# EAGLE board ADC_12_channel (EAGLE 7.2.0)
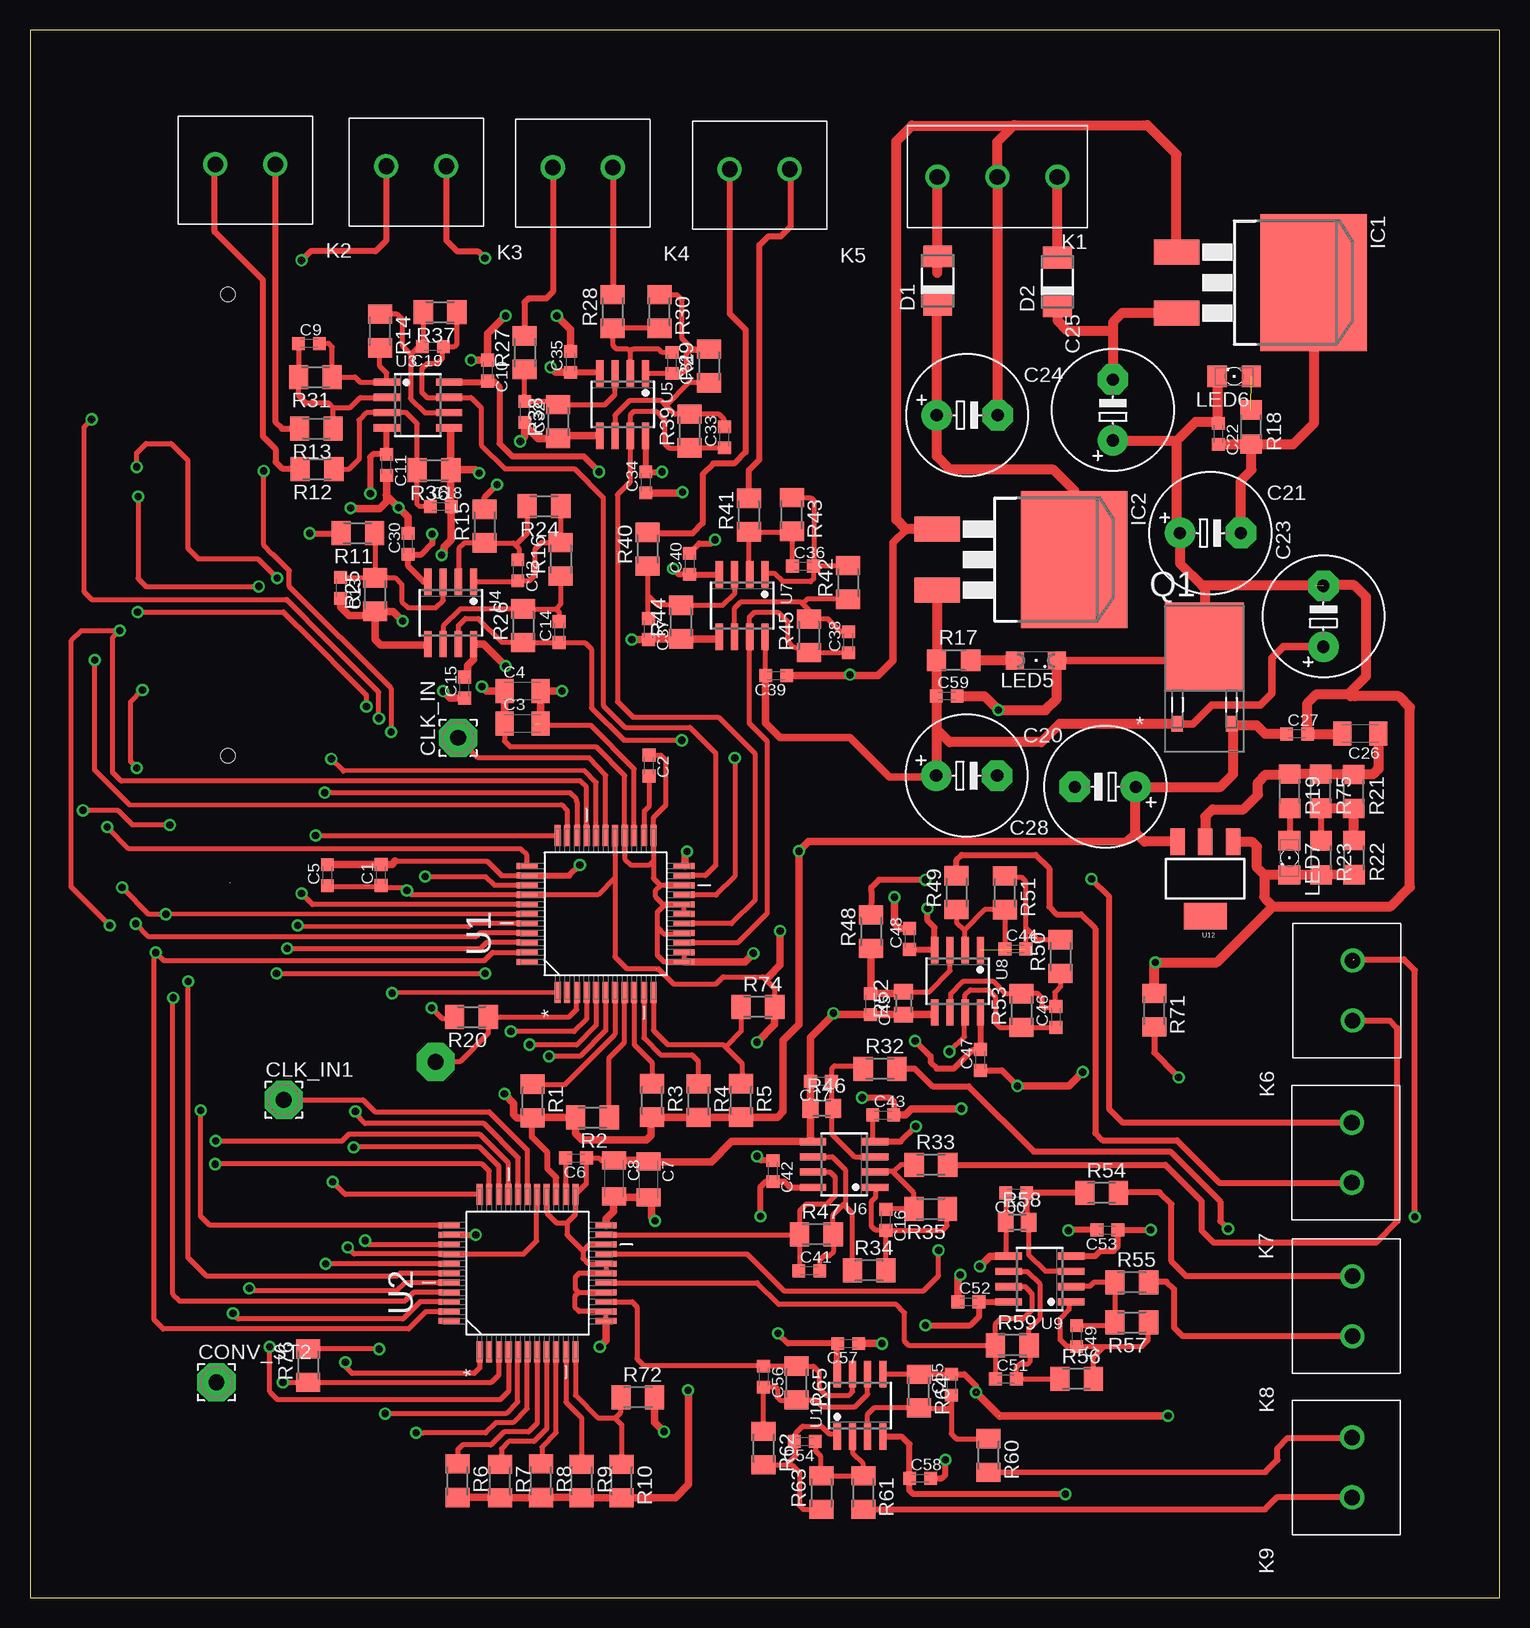
[diagram p5: board, top side]
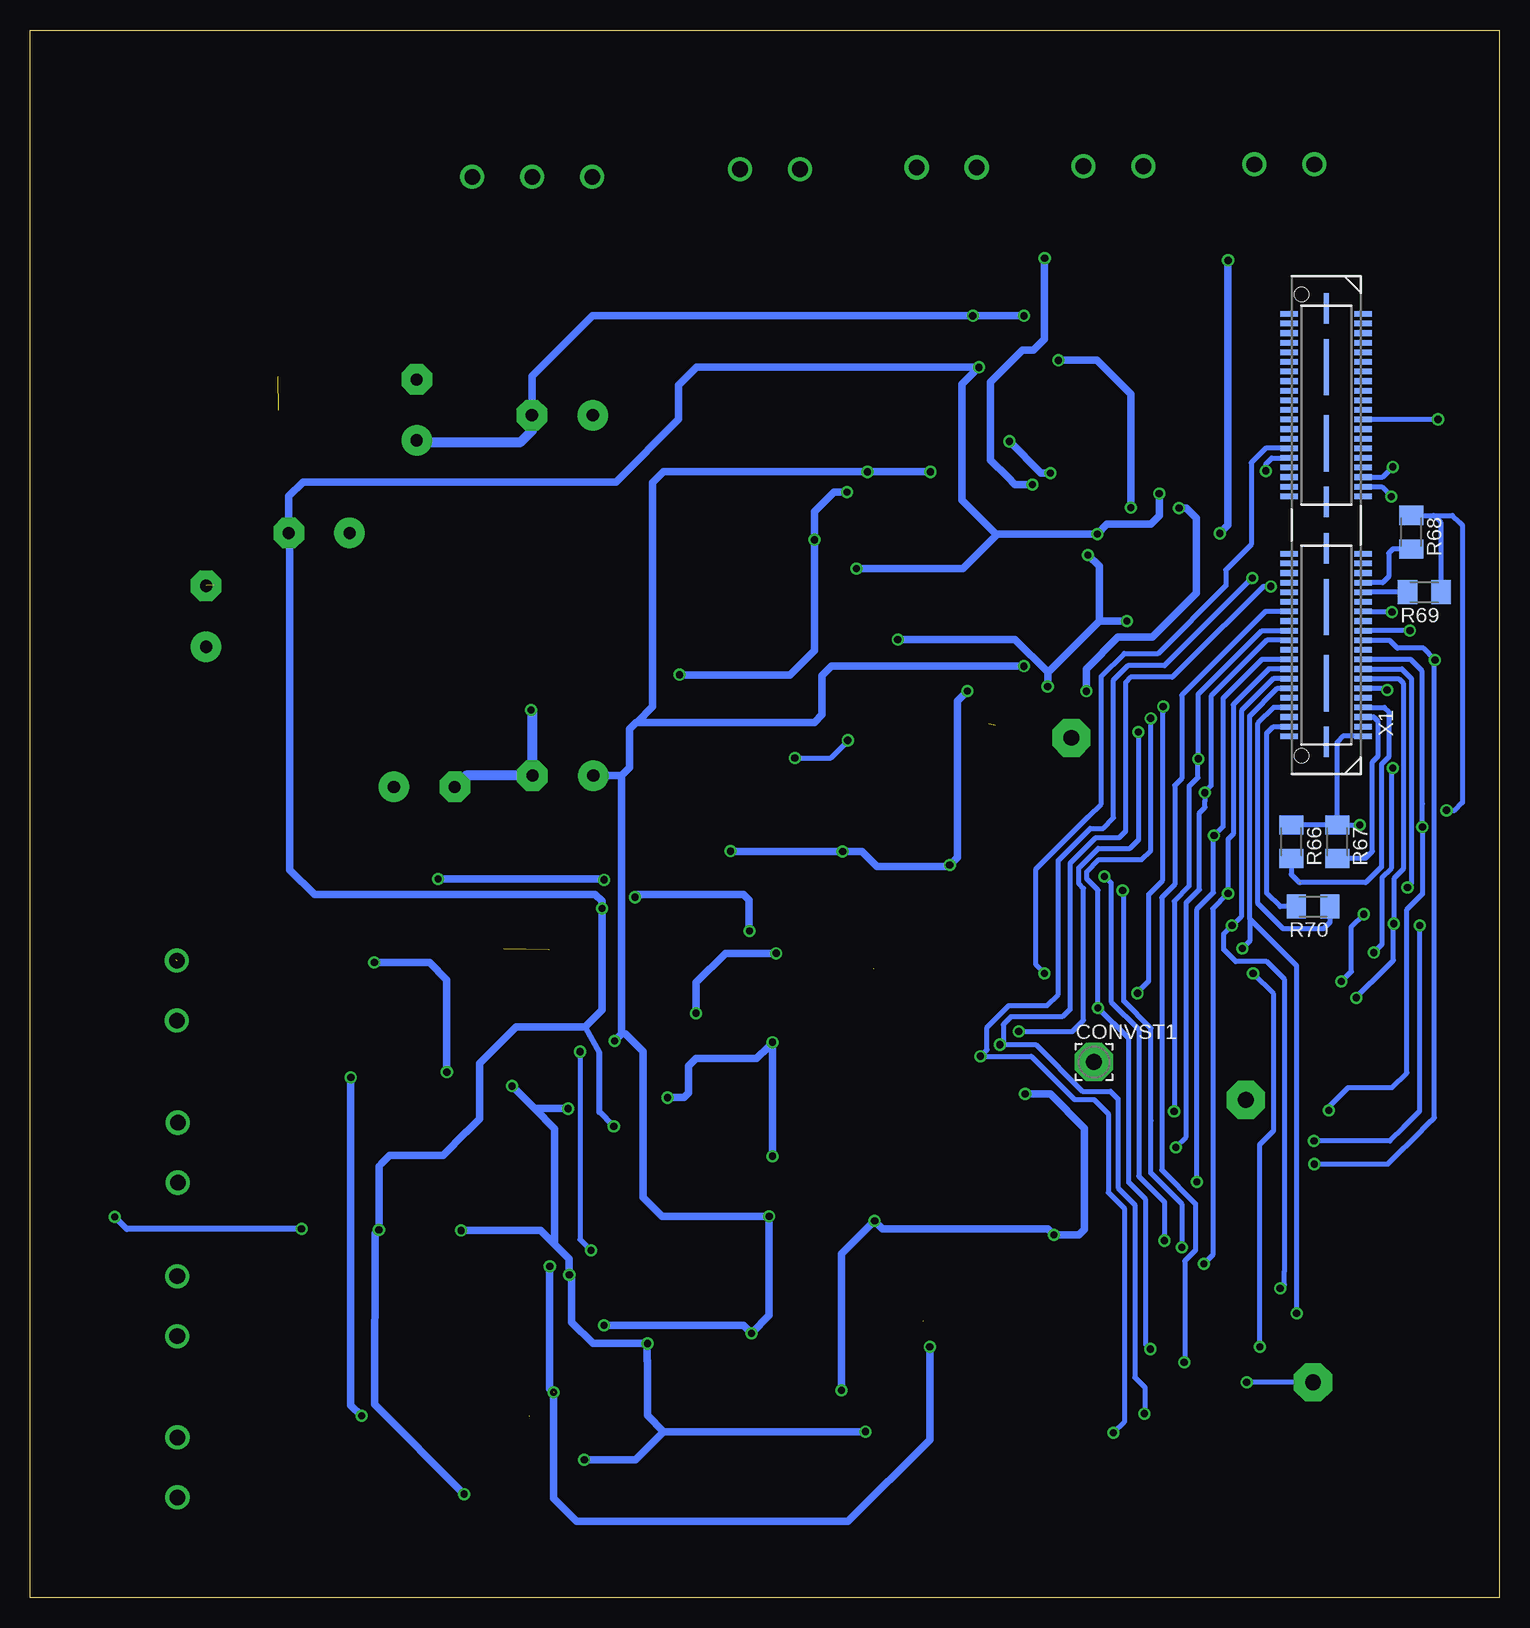
[diagram p6: board, bottom side, seen from below]

Size 122.5 x 130.68 mm. Coordinates in mm from the lower left corner, seen from the top.
Outline: 122.48,130.68 0.03,130.68 0.03,18.08
Outline: 0,18.34 0.03,18.34 0.03,0 122.5,0 122.5,130.68 122.48,130.68
Copper layers (1*16): Top 0.035mm / dielectric 1.5mm / Bottom 0.035mm
Design rules "default *": minimum track width 16mil, minimum drill 24mil, track to track 10mil, track to pad 10mil, pad to pad 10mil, via to via 10mil, smd to smd 8mil, copper to edge 40mil, drill to drill 8mil, minimum pad ring 14mil, minimum via ring 8mil, stop-mask expansion 4mil, vias tented up to drill 0mil, thermal gap 10mil

## Footprints (pad centres in the part's own frame; a part is rotated, then mirrored left to right if it is on the bottom)
C0603K = smd 1.05 x 1.08: 1 -0.875,0; 2 0.875,0
C1206K = smd 1.5 x 2: 1 -1.5,0; 2 1.5,0
E5-10,5 = drill 1.016 pad 2.54: + -2.54,0 | drill 1.016 pad 2.54 octagon: - 2.54,0
3,17/1,3 = drill 1.321 pad 3.175 octagon: 1 0,0
DO-214AC = smd 1.8 x 2.4: A 2.025,0; C -2.025,0
D2PACK = smd 2.083 x 3.81: 1 -2.54,-8.89; 3 2.54,-8.89 | smd 11.43 x 8.89: 2 0,2.54
691131710003 = drill 1.3: 1 -5,0; 2 0,0; 3 5,0
691101710002 = drill 1.3: 1 -5,0; 2 0,0
SML1206 = smd 1.5 x 1.5: A 1.75,0; C -1.75,0
1206 = smd 1.6 x 1.803: A -1.422,0; C 1.422,0
TO225P972X240-3N = smd 0.94 x 1.321: 1 -2.261,-6.299; 3 2.261,-6.299 | smd 6.604 x 7.315: 2 0,0.152
M1206 = smd 1.6 x 2: 1 -1.4,0; 2 1.4,0
R1206 = smd 1.6 x 1.803: 1 -1.422,0; 2 1.422,0
M0805 = smd 1.3 x 1.6: 1 -0.95,0; 2 0.95,0
QFP80P1390X1390X245-44N = smd 1.753 x 0.508: 1 -6.553,3.988; 2 -6.553,3.2; 3 -6.553,2.388; 4 -6.553,1.6; 5 -6.553,0.787; 6 -6.553,0; 7 -6.553,-0.787; 8 -6.553,-1.6; 9 -6.553,-2.388; 10 -6.553,-3.2; 11 -6.553,-3.988; 23 6.553,-3.988; 24 6.553,-3.2; 25 6.553,-2.388; 26 6.553,-1.6; 27 6.553,-0.787; 28 6.553,0; 29 6.553,0.787; 30 6.553,1.6; 31 6.553,2.388; 32 6.553,3.2; 33 6.553,3.988 | smd 0.508 x 1.753: 12 -3.988,-6.553; 13 -3.2,-6.553; 14 -2.388,-6.553; 15 -1.6,-6.553; 16 -0.787,-6.553; 17 0,-6.553; 18 0.787,-6.553; 19 1.6,-6.553; 20 2.388,-6.553; 21 3.2,-6.553; 22 3.988,-6.553; 34 3.988,6.553; 35 3.2,6.553; 36 2.388,6.553; 37 1.6,6.553; 38 0.787,6.553; 39 0,6.553; 40 -0.787,6.553; 41 -1.6,6.553; 42 -2.388,6.553; 43 -3.2,6.553; 44 -3.988,6.553
SO08 = smd 0.6 x 2.2: 1 -1.905,-2.6; 2 -0.635,-2.6; 3 0.635,-2.6; 4 1.905,-2.6; 5 1.905,2.6; 6 0.635,2.6; 7 -0.635,2.6; 8 -1.905,2.6
SOT223 = smd 1.219 x 2.235: 1 -2.311,-3.099; 2 0,-3.099; 3 2.311,-3.099 | smd 3.6 x 2.2: 4 0,3.099
QTE-040 = smd 0.46 x 1.45: 1 -17.595,3.09; 2 -17.595,-3.08; 3 -16.795,3.09; 4 -16.795,-3.08; 5 -15.995,3.09; 6 -15.995,-3.08; 7 -15.195,3.09; 8 -15.195,-3.08; 9 -14.395,3.09; 10 -14.395,-3.08; 11 -13.595,3.09; 12 -13.595,-3.08; 13 -12.795,3.09; 14 -12.795,-3.08; 15 -11.995,3.09; 16 -11.995,-3.08; 17 -11.195,3.09; 18 -11.195,-3.08; 19 -10.395,3.09; 20 -10.395,-3.08; 21 -9.595,3.09; 22 -9.595,-3.08; 23 -8.795,3.09; 24 -8.795,-3.08; 25 -7.995,3.09; 26 -7.995,-3.08; 27 -7.195,3.09; 28 -7.195,-3.08; 29 -6.395,3.09; 30 -6.395,-3.08; 31 -5.595,3.09; 32 -5.595,-3.08; 33 -4.795,3.09; 34 -4.795,-3.08; 35 -3.995,3.09; 36 -3.995,-3.08; 37 -3.195,3.09; 38 -3.195,-3.08; 39 -2.395,3.09; 40 -2.395,-3.08; 41 2.405,3.09; 42 2.405,-3.08; 43 3.205,3.09; 44 3.205,-3.08; 45 4.005,3.09; 46 4.005,-3.08; 47 4.805,3.09; 48 4.805,-3.08; 49 5.605,3.09; 50 5.605,-3.08; 51 6.405,3.09; 52 6.405,-3.08; 53 7.205,3.09; 54 7.205,-3.08; 55 8.005,3.09; 56 8.005,-3.08; 57 8.805,3.09; 58 8.805,-3.08; 59 9.605,3.09; 60 9.605,-3.08; 61 10.405,3.09; 62 10.405,-3.08; 63 11.205,3.09; 64 11.205,-3.08; 65 12.005,3.09; 66 12.005,-3.08; 67 12.805,3.09; 68 12.805,-3.08; 69 13.605,3.09; 70 13.605,-3.08; 71 14.405,3.09; 72 14.405,-3.08; 73 15.205,3.09; 74 15.205,-3.08; 75 16.005,3.09; 76 16.005,-3.08; 77 16.805,3.09; 78 16.805,-3.08; 79 17.605,3.09; 80 17.605,-3.08 | smd 2.54 x 0.43: M1 -18.065,0; M2 -1.935,0; M5 1.935,0; M6 18.065,0 | smd 4.7 x 0.43: M3 -13.175,0; M4 -6.825,0; M7 6.825,0; M8 13.175,0 | hole 1.19: -19.24,2.04; 19.24,2.04

## Placement (x,y rotation side)
C1  0.1u  [C0603K]  29.26,60.25 90 top
C2  0.1uf  [C0603K]  51.59,69.37 270 top
C3  47u  [C1206K]  41.05,72.87 0 top
C4  47u  [C1206K]  41.05,75.56 0 top
C5  0.1u  [C0603K]  24.79,60.22 90 top
C6  [C0603K]  45.52,36.65 180 top
C7  47u  [C1206K]  51.56,34.87 270 top
C8  47u  [C1206K]  48.69,34.95 270 top
C9  0.1u  [C0603K]  23.27,104.55 0 top
C10  0.1u  [C0603K]  38.15,102.29 270 top
C11  0.1u  [C0603K]  29.72,94.44 270 top
C12  0.1u  [C0603K]  40.67,85.65 270 top
C13  0.1u  [C0603K]  25.91,84.18 270 top
C14  0.1u  [C0603K]  44.12,80.49 90 top
C15  0.1u  [C0603K]  36.22,75.87 90 top
C16  0.1u  [C0603K]  71.35,31.5 270 top
C17  0.1u  [C0603K]  65.94,43.05 180 top
C18  0.1u  [C0603K]  34.24,90.96 0 top
C19  0.1u  [C0603K]  33.58,104.29 180 top
C20  250uF  [E5-10,5]  78.08,68.53 0 top
C21  250uF  [E5-10,5]  98.4,88.75 0 top
C22  0.1u  [C0603K]  99.06,97.03 270 top
C23  1000uF/35V  [E5-10,5]  107.82,81.81 90 top
C24  1000uF/35V  [E5-10,5]  78.13,98.58 0 top
C25  1000uF/35v  [E5-10,5]  90.27,99.01 90 top
C26  [C1206K]  110.9,72.03 180 top
C27  0.1u  [C0603K]  105.61,72.01 0 top
C28  1000uF/35V  [E5-10,5]  89.64,67.59 180 top
C30  0.1u  [C0603K]  31.52,87.83 90 top
C31  0.1u  [C0603K]  53.52,102.92 270 top
C32  0.1u  [C0603K]  41.25,98.86 270 top
C33  0.1u  [C0603K]  57.89,96.72 90 top
C34  0.1u  [C0603K]  51.33,92.96 90 top
C35  0.1u  [C0603K]  45.06,103.02 90 top
C36  0.1u  [C0603K]  64.44,85.98 0 top
C37  0.1u  [C0603K]  51.56,80.75 270 top
C38  0.1u  [C0603K]  68.22,79.63 90 top
C39  0.1u  [C0603K]  62.2,76.86 180 top
C40  0.1u  [C0603K]  54.99,86.18 90 top
C41  0.1u  [C0603K]  64.97,27.25 0 top
C42  0.1u  [C0603K]  61.93,35.56 270 top
C43  0.1u  [C0603K]  71.12,40.23 0 top
C44  0.1u  [C0603K]  82.14,54.08 0 top
C45  0.1u  [C0603K]  70.05,49.48 270 top
C46  0.1u  [C0603K]  85.52,48.41 90 top
C47  0.1u  [C0603K]  79.22,44.83 90 top
C48  0.1u  [C0603K]  73.33,54.91 90 top
C49  0.1u  [C0603K]  87.25,21.82 270 top
C50  0.1u  [C0603K]  82.22,33.73 180 top
C51  0.1u  [C0603K]  81.36,18.24 0 top
C52  0.1u  [C0603K]  78.23,24.66 0 top
C53  0.1u  [C0603K]  89.81,30.66 180 top
C54  0.1u  [C0603K]  64.59,13.03 180 top
C55  0.1u  [C0603K]  76.81,17.75 90 top
C56  0.1u  [C0603K]  61.16,18.44 270 top
C57  0.1u  [C0603K]  68.22,21.18 180 top
C58  0.1u  [C0603K]  74.19,9.96 0 top
C59  0.1u  [C0603K]  76.43,75.16 0 top
CLK_IN  [3,17/1,3]  35.69,71.68 90 top
CLK_IN1  [3,17/1,3]  21.16,41.5 0 top
CONV_ST2  [3,17/1,3]  15.54,17.96 0 top
CONVST1  [3,17/1,3]  33.81,44.65 0 bottom
D1  [DO-214AC]  75.67,109.78 90 top
D2  [DO-214AC]  85.65,109.68 90 top
IC1  LM317BD2T  [D2PACK]  104.47,109.63 270 top
IC2  LM317BD2T  [D2PACK]  84.51,86.54 270 top
K1  691131710003  [691131710003]  80.65,118.44 180 top
K2  691101710002  [691101710002]  15.44,119.48 180 top
K3  691101710002  [691101710002]  29.69,119.33 180 top
K4  691101710002  [691101710002]  43.59,119.23 180 top
K5  691101710002  [691101710002]  58.32,119.08 180 top
K6  691101710002  [691101710002]  110.26,53.11 90 top
K7  691101710002  [691101710002]  110.19,39.6 90 top
K8  691101710002  [691101710002]  110.24,26.8 90 top
K9  691101710002  [691101710002]  110.21,13.36 90 top
LED5  [SML1206]  83.87,78.13 180 top
LED6  [1206]  100.38,101.8 180 top
LED7  [1206]  104.98,61.67 270 top
Q1  L78M12ABDT  [TO225P972X240-3N]  97.89,79.15 0 top
R1  10k  [M1206]  41.91,41.4 270 top
R2  10k  [M1206]  46.89,40.03 180 top
R3  10k  [M1206]  51.87,41.45 270 top
R4  10k  [M1206]  55.73,41.43 270 top
R5  10k  [M1206]  59.28,41.45 270 top
R6  10k  [M1206]  35.64,9.75 270 top
R7  10k  [M1206]  39.19,9.73 270 top
R8  10k  [M1206]  42.6,9.75 270 top
R9  10k  [M1206]  46,9.73 270 top
R10  10k  [M1206]  49.33,9.73 270 top
R11  10M  [M1206]  27.33,88.75 180 top
R12  10M  [M1206]  23.93,94.08 180 top
R13  10M  [M1206]  23.88,97.46 180 top
R14  10M  [M1206]  29.18,105.59 270 top
R15  10M  [M1206]  37.9,89.33 90 top
R16  10M  [M1206]  44.25,86.56 90 top
R17  2.2k  [R1206]  76.99,78.16 0 top
R18  2.2k  [R1206]  101.78,97.59 270 top
R19  2.2k  [R1206]  105,67.23 270 top
R20  0  [M1206]  36.8,48.41 180 top
R21  100k  [R1206]  110.34,67.21 270 top
R22  20k(19k)  [R1206]  110.36,61.7 270 top
R23  20k(19k)  [R1206]  107.62,61.67 270 top
R24  10M  [M1206]  42.85,90.98 180 top
R25  10M  [M1206]  28.75,83.62 90 top
R26  10M  [M1206]  41.12,81.03 90 top
R27  10M  [M1206]  41.25,103.78 90 top
R28  10M  [M1206]  48.56,107.21 90 top
R29  10M  [M1206]  56.59,102.67 90 top
R30  10M  [M1206]  52.48,107.21 270 top
R31  10M  [M1206]  23.8,101.75 180 top
R32  10M  [M1206]  70.87,44.09 0 top
R33  10M  [M1206]  75.11,36.09 0 top
R34  10M  [M1206]  69.95,27.28 0 top
R35  10M  [M1206]  75.08,32.41 180 top
R36  10M  [M1206]  33.68,94.01 180 top
R37  10M  [M1206]  34.19,107.16 180 top
R38  10M  [M1206]  44.02,98.04 90 top
R39  10M  [M1206]  54.99,97.26 90 top
R40  10M  [M1206]  51.49,87.4 90 top
R41  10M  [M1206]  59.92,90.25 90 top
R42  10M  [M1206]  68.2,84.63 90 top
R43  10M  [M1206]  63.5,90.3 270 top
R44  10M  [M1206]  54.25,81.33 90 top
R45  10M  [M1206]  64.92,80.19 90 top
R46  10M  [M0805]  66.01,40.79 0 top
R47  10M  [M1206]  65.56,30.3 0 top
R48  10M  [M1206]  70.1,55.52 90 top
R49  10M  [M1206]  77.24,58.78 90 top
R50  10M  [M1206]  85.9,53.44 90 top
R51  10M  [M1206]  81.28,58.75 270 top
R52  10M  [M0805]  72.82,49.56 90 top
R53  10M  [M1206]  82.65,48.95 90 top
R54  10M  [M1206]  89.33,33.73 0 top
R55  10M  [M1206]  91.85,26.29 0 top
R56  10M  [M1206]  87.25,18.24 0 top
R57  10M  [M1206]  91.85,22.96 180 top
R58  10M  [M0805]  82.3,31.29 0 top
R59  10M  [M1206]  81.89,21.06 0 top
R60  10M  [M1206]  79.91,11.86 270 top
R61  10M  [M1206]  69.47,8.76 270 top
R62  10M  [M1206]  61.16,12.47 270 top
R63  10M  [M1206]  65.96,8.76 90 top
R64  10M  [M1206]  74.12,17.22 270 top
R65  10M  [M1206]  63.91,17.91 270 top
R66  500  [M1206]  17.37,63.02 270 bottom
R67  500  [M1206]  13.54,63.02 270 bottom
R68  500  [M1206]  7.37,88.82 270 bottom
R69  500  [M1206]  6.27,83.82 180 bottom
R70  500  [M1206]  15.54,57.61 180 bottom
R71  0  [M1206]  93.73,48.97 270 top
R72  0  [M1206]  50.67,16.71 0 top
R74  0  [M1206]  60.68,49.25 0 top
R75  100k  [R1206]  107.59,67.23 270 top
R76  0  [M1206]  23.19,19.35 90 top
U1  AD7864ASZ-1  [QFP80P1390X1390X245-44N]  47.98,57 90 top
U2  AD7864ASZ-1  [QFP80P1390X1390X245-44N]  41.48,27.05 90 top
U3  TL082D  [SO08]  32.33,99.42 270 top
U4  TL082D  [SO08]  35.08,82.09 180 top
U5  TL082D  [SO08]  49.4,99.47 180 top
U6  TL082D  [SO08]  67.87,36.12 90 top
U7  TL082D  [SO08]  59.36,82.7 180 top
U8  TL082D  [SO08]  77.32,51.38 180 top
U9  TL082D  [SO08]  84.18,26.57 90 top
U10  TL082D  [SO08]  69.19,16.03 0 top
U12  V_REG_317SMD  [SOT223]  97.97,59.92 180 top
X1  QTE-040  [QTE-040]  14.45,89.41 90 bottom

## Tracks (layer width: path | path; a pad name or v marks a point on that pad's centre or on a via)
3V
  Top 0.508: 107.62,65.79 R23.1
  Top 0.813: R75.2 107.62,65.79 R21.2 110.36,65.76 R22.1
ADC1
  Top 0.406: R37.1 35.59,104.5 35.38,104.29 C19.1 34.39,104.23 34.39,103.33 33.96,102.9 33.15,102.9 32.66,102.41 32.66,100.48 33.1,100.05 U3.7 36.75,100.05 37.62,99.19 37.62,96.09 39.6,94.11 45.39,94.11 47.78,91.72 47.78,74.37 49.61,72.54 55.02,72.54 57.15,70.41 57.15,61.04 56.31,60.2 U1.21
ADC2  (via drill 0.6)
  Top 0.406: v54.33,71.48 49.5,71.48 46.81,74.17 46.81,79.07 46.26,79.62 C14.1 R26.1 41.09,79.65 39.34,79.65 37.36,81.64 36.3,81.64 35.71,81.05 U4.7 | v58.75,70 58.75,60.12 57.2,58.57 54.56,58.57 U1.19
  Bottom 0.406: v54.33,71.48 54.33,71.4 55.73,70 v58.75,70
ADC3
  Top 0.406: U1.16 54.56,56.19 58.5,56.19 60.43,58.11 60.43,70.36 57.38,73.41 50.27,73.41 48.97,74.7 48.97,91.95 50.04,93.01 U5.7 50.06,96.89 50.06,98.63 50.34,98.91 52.17,98.91 52.91,98.17 52.91,96.22 53.29,95.83 54.97,95.83 R39.1 C33.1
ADC4
  Top 0.406: 59.94,80.15 59.94,81.71 60.35,82.12 62.38,82.12 63.17,81.33 63.17,79.73 63.66,79.24 R45.1 68.19,78.79 C38.1 | 59.94,80.15 U7.7 | 59.94,80.15 59.94,72.9 61.42,71.42 61.42,57.02 59,54.61 U1.14
ADC5
  Top 0.406: U6.7 66.7,35.48 67.11,35.08 67.11,33.5 66.4,32.79 64.69,32.79 64.16,32.26 R47.1 | R47.1 64.16,27.31 C41.1 | U2.21 64.11,30.25 R47.1
ADC6  (via drill 0.6)
  Top 0.406: C46.1 R53.1 80.82,47.55 80.47,47.9 80.47,50.09 79.88,50.67 78.36,50.67 77.95,50.27 U8.7 77.9,48.73 77.9,46.76 v76.66,45.52 | U2.19 59.79,28.65 62.86,25.58 74.47,25.58 75.74,26.85 v75.74,28.96
  Bottom 0.406: v76.66,45.52 76.66,29.87 v75.74,28.96
ADC7
  Top 0.406: U9.7 82.96,25.93 83.36,25.53 83.36,25.5 83.52,25.35 83.52,23.98 82.78,23.24 80.9,23.24 80.44,22.78 80.44,21.1 R59.1 | R59.1 C51.1 | U2.16 60.6,26.26 62.43,24.43 72.21,24.43 72.9,23.75 72.9,21.39 73.28,21.01 80.44,21.01 R59.1
ADC8
  Top 0.406: U2.14 50.19,24.66 50.6,24.26 50.6,19.91 51.16,19.35 61.12,19.35 C56.1 R65.1 65.3,19.31 65.79,18.82 65.79,17.45 66.34,16.89 68.3,16.89 68.58,17.17 68.58,18.6 U10.7
AGND  (via drill 0.6)  (3 unrouted)
  Top 0.254: 54.53,53.03 U1.12
  Top 0.406: U1.20 52.55,59.38 | U1.18 52.93,57.78 52.27,57.12 52.27,55.91 52.3,55.88 | 52.3,55.88 52.83,55.35 54.48,55.35 U1.15 | 52.3,55.88 52.3,53.54 52.81,53.03 54.51,53.03 U1.12 U1.13 | U1.17 U1.18 | U1.18 52.78,57.78 52.15,58.42 52.15,58.98 52.55,59.38 | 34.9,97.48 U3.5 35.08,97.36 | U2.26 43.08,32.08 43.92,31.24 44.75,31.24 | 44.75,31.24 45.47,31.95 U2.23 46.39,34.53 C6.1 47.42,36.65 47.62,36.45 C8.1 | U2.20 46.63,29.44 46.1,28.9 | 46.1,28.9 46.1,28.27 46.53,27.84 U2.18 U2.17 45.77,27.05 45.44,26.72 45.44,25.73 45.72,25.45 | U2.12 U2.13 45.77,23.85 45.44,24.18 45.44,25.17 45.72,25.45 | 44.75,31.24 44.75,30.25 46.1,28.9 | R36.1 35.08,94.26 35.31,94.03 | 35.08,90.99 C18.2 | 44.24,96.87 R38.1 44,96.62 | C17.2 | R52.1 | 75.23,48.6 U8.5 | U9.5 81.35,28.7 R58.1 C50.2 | U10.5 R64.1 74.13,18.63 C55.2 | 33.08,79.4 U4.5 | 28.4,81.86 R25.1 | 51.49,36.45 C7.1 | 50.18,79.87 v50.16,79.88 | 57.28,79.93 U7.5 | 66.98,48.64 67.06,48.64 v66.98,48.72 | 70.02,48.64 C45.2 | 45.72,25.45 U2.15 | 94.64,44.53 94.64,44.5 | 47.96,23.09 48.01,23.04 | C32.2 41.25,97.74 | v37.44,93.75 37.41,93.73 | 51.97,61.42 U1.23 51.97,65.02 52.98,66.04 52.98,69.82 52.57,70.24 C2.1 | 51.97,61.42 51.97,59.97 52.55,59.38 | 51.97,61.42 51.64,61.09 50.09,61.09 49.58,61.59 U1.26 49.58,68.53 47.17,70.94 40,70.94 39.55,71.4 C3.1
  Top 0.508: C55.2 77.89,18.63 78.87,17.65 v78.87,17.12 | C8.1 | 65.06,38.23 U6.5 | 51.59,36.35 C7.1 | R71.2 93.73,45.44 94.64,44.53 | 94.64,44.5 v95.76,43.38 | 51.62,79.93 C37.2
  Top 0.61: C3.1 C4.1 38.05,75.56 v37.67,75.95 | R36.1 35.08,90.99 | U5.5 44.24,96.87 | C17.2 R46.1 65.06,38.23 | C45.2 R52.1 | R52.1 75.23,48.6 | C13.2 25.91,82.57 26.62,81.86 28.4,81.86 | C8.1 51.49,36.45 | 33.08,79.4 29.21,79.4 28.75,79.86 R25.1 30.25,82.22 v31.06,81.41 | C37.2 50.18,79.87 | 57.28,79.93 R44.1 51.62,79.93 | U9.5 80.04,28.47 v79.17,27.61 | U6.5 58.5,38.02 56.82,36.35 51.59,36.35 | C17.2 65.06,46.72 66.98,48.64 | 67.06,48.64 70.02,48.64 | v60.3,53.72 59.59,53.01 U1.12 | C18.2 35.11,88.17 34.52,87.58 34.52,87.12 v34.32,86.92 | 41.25,97.74 42.37,96.62 44,96.62 | 35.08,97.36 35.08,94.26 | 35.31,94.03 37.11,94.03 37.41,93.73 | C32.2 41.25,96.77 v40.87,96.39 | U2.12 48.03,21.44 v47.5,20.9 | v94.87,15.16 80.87,15.16 | 80.85,15.14 v78.87,17.12
  Bottom 0.406: 79.17,17.42 v78.87,17.12 | 37.67,77.16 37.62,77.16
  Bottom 0.508: 37.67,77.11 37.62,77.16
  Bottom 0.61: v50.16,79.88 40.39,79.88 37.67,77.16 | v79.17,27.61 79.17,17.42 | v60.3,53.72 64.54,53.72 66.98,51.28 v66.98,48.72 | v47.5,20.9 47.5,13.16 54.31,6.35 76.94,6.35 78.87,8.28 78.87,17.17 | 37.62,77.16 33.38,81.41 | v31.06,81.41 33.38,81.41 | 33.38,81.41 33.38,85.98 v34.32,86.92 | v37.44,93.75 38.23,93.75 v40.87,96.39 | v37.67,75.95 37.67,77.11 | v95.76,43.38 95.76,16.05 v94.87,15.16
CONVST  (via drill 0.6)
  Top 0.406: v33.48,49.17 34.37,48.28 35.4,48.28 R20.2 | v29.08,73.3 29.08,75.49 23.14,81.43 23.14,81.46 21.39,83.21 5.13,83.21 4.52,83.82 4.52,97.61 v5.13,98.22 | v29.11,20.73 23.22,20.73 R76.2
  Bottom 0.406: v29.08,73.3 29.08,62.28 29.84,61.52 33.4,61.52 34.42,60.5 34.42,59.92 33.48,58.98 v33.48,49.17 30.91,46.61 30.91,34.62 29.49,33.2 29.49,21.11 v29.11,20.73 | v5.13,98.22 11.36,98.22 X1.58
CS2N  (via drill 0.6)
  Top 0.406: U1.4 46.38,48.21 45.36,47.19 v40.08,47.19 | v19.48,93.93 19.48,87.73 20.24,86.97 20.27,86.97 21.62,85.62 21.62,84.3 30.1,75.82 v30.1,72.16
  Bottom 0.406: v40.08,47.19 35.61,47.19 34.67,48.13 34.67,59.13 35.08,59.54 35.08,60.83 33.45,62.46 30.81,62.46 30.1,63.17 v30.1,72.16 | v19.48,93.93 19.48,94.51 19,95 17.56,95 X1.49
CS3N  (via drill 0.6)
  Top 0.406: U2.4 39.88,17.2 39.19,16.51 20.65,16.51 19.99,17.17 v19.99,20.9 | v20.55,52.04 v37.95,52.04
  Bottom 0.406: v19.99,20.9 19.99,37.77 18.82,38.94 18.82,50.32 v20.55,52.04 | v37.95,52.04 37.95,52.07 38.63,52.76 38.63,60.76 34.29,65.1 34.26,65.1 33.2,66.17 33.2,76.81 31.29,78.72 28.45,78.72 22.81,84.35 22.83,84.38 22.83,85.67 20.7,87.81 20.7,94.61 19.5,95.81 X1.51
DGND  (via drill 0.6)  (2 unrouted)
  Top 0.406: C5.1 24.89,59.3 29.19,59.3 C1.1 29.38,59.18 31.19,59.18 v31.42,58.95 31.78,58.6 U1.37 47.35,58.6 48.77,60.02 | 29.69,91.92 29.69,93.54 C11.2 | U1.27 48.77,60.02 | 48.77,60.02 48.77,53.42 49.73,52.45 52.17,52.45 | U2.27 42.24,33.58 42.24,29.74 41.15,28.65 U2.37 27.03,28.65 26.49,29.18 v26.49,29.21 | 52.17,52.43 52.4,52.43 53.64,51.18 57.2,51.18 57.78,51.77 61.09,51.77 | 61.09,51.77 62.08,50.77 R74.2 | 61.09,51.77 61.57,51.77
  Top 0.508: 75.06,9.97 76.03,9.97 76.3,10.24 v76.3,11.51 | 100.3,62.99 U12.1 | 102.89,58.45 102.95,58.39 102.95,58.29 | C53.2 86.61,30.66 v86.56,30.61 | C43.2 72.01,40.25 72.01,41.35 71.68,41.68 69.9,41.68 v69.37,41.68 | C42.1 60.97,36.43 v60.6,36.8 | R74.2 | C47.1 81.01,43.96 v82.32,42.65 | C40.2 54.99,87.07 55.8,87.88 56.79,87.88 v57.1,88.19
  Top 0.61: LED5.C 96.72,78.13 Q1.2 | C30.2 31.52,90.09 v30.73,90.88 29.69,91.92 | C11.2 29.72,91.39 29.13,90.81 26.75,90.81 v26.72,90.83 | C57.1 v71.02,21.18 | R72.2 52.07,14.63 v52.86,13.84 | C43.2 72.97,40.23 73.48,40.74 77.52,40.74 v77.65,40.77 | 82.22,42.65 v82.32,42.65 86.59,42.65 v87.76,43.81 | C48.2 72.48,55.79 72.06,56.21 v72.06,58.39 | 73.1,89.08 71.96,87.94 71.96,78.13 70.69,76.86 68.43,76.86 v68.35,76.94 68.28,76.86 C39.1 | v36.78,103.15 36.79,103.16 C10.1 38.15,105.38 39.01,106.25 39.04,106.25 v39.65,106.86 | C34.1 54.34,92.09 v54.41,92.15 | C35.2 45.06,105.72 v43.92,106.86 | 75.06,9.97 C58.2 | C52.1 77.36,26.73 v77.55,26.92 | 110.44,75.16 110.08,75.16 | v60.6,46.3 62.08,47.78 R74.2 | C15.1 35.01,75 v34.44,75.56 | v62.53,55.57 62.53,52.73 61.57,51.77
  Top 0.813: C59.2 79.55,75.16 v80.72,73.99 84.66,73.99 85.6,74.93 85.6,78.11 LED5.C | C24.- 80.64,98.6 K1.2 80.64,121.36 81.99,122.71 | LED6.C 98.96,98 | 98.96,98 C22.1 | 98.96,98 97.17,98 95.55,96.39 | IC1.1 95.58,120.32 93.14,122.76 82.04,122.76 81.99,122.71 | 97.71,84.35 97.94,84.12 97.94,78.76 98.02,78.69 98.02,79.17 Q1.2 | 97.71,84.35 107.09,84.35 107.14,84.4 110.39,84.4 111.38,83.41 111.38,76.81 109.91,75.34 110.08,75.16 | 97.71,84.35 95.86,86.21 C21.+ 95.55,89.05 95.55,96.39 | LED7.C R23.2 R22.2 110.74,60.32 | 105.26,59.97 LED7.C | C26.2 109.37,72.01 C27.2 106.49,74.56 107.24,75.31 110.29,75.31 110.44,75.16 114.1,75.16 115.04,74.22 115.04,59.23 113.44,57.63 103.61,57.63 | IC2.1 73.1,89.08 73,89.08 72.21,89.86 72.21,121.41 73.51,122.71 81.99,122.71 | LED7.C 102.89,60.25 | 102.89,60.25 102.29,60.86 102.29,62.61 101.9,62.99 100.3,62.99 | 102.89,60.25 102.89,58.45 | 102.95,58.29 103.61,57.63 | R71.1 93.73,52.88 v93.8,52.96 98.93,52.96 103.61,57.63 | 95.55,96.39 90.35,96.39 C25.+
  Bottom 0.406: v31.42,58.95 31.32,58.85 31.32,49.73 29.06,47.47 29.06,39.78 29.08,39.75 29.08,35.41 26.49,32.82 v26.49,29.21
  Bottom 0.508: v60.6,46.3 60.96,45.95 60.96,45.92 | 34.44,77.42 34.39,77.47 | 71.7,58.62 71.83,58.62 | 69.34,41.71 v69.37,41.68
  Bottom 0.61: v26.72,90.83 26.11,90.83 25.27,89.99 25.27,83.74 28.96,80.06 31.8,80.06 34.39,77.47 | v87.76,43.81 87.76,51.51 89.18,52.93 93.78,52.93 v93.8,52.96 | 36.4,103.15 v36.78,103.15 33.55,103.15 30.73,100.33 v30.73,90.88 | v39.65,106.86 v43.92,106.86 75.62,106.86 80.64,101.83 80.64,98.6 C24.- | v77.65,40.77 79.98,40.77 | 79.98,40.77 80.44,40.77 | 80.44,40.77 v82.32,42.65 | v77.55,26.92 77.34,26.72 77.34,22.96 75.56,21.18 v71.02,21.18 71.07,21.13 71.07,19.76 71.04,19.74 71.04,15.21 69.67,13.84 | v77.55,26.92 77.55,26.95 | 80.04,40.72 79.98,40.77 | 78.77,29.44 77.57,28.24 77.57,26.95 v77.55,26.92 | 78.77,29.44 78.77,39.09 80.44,40.77 | v86.56,30.61 79.93,30.61 78.77,29.44 | 71.7,58.62 63.02,58.62 62.56,58.17 62.56,55.6 v62.53,55.57 | v60.6,36.8 v60.6,46.3 | v54.41,92.15 55.47,92.15 57.1,90.53 v57.1,88.19 57.1,78.97 59.16,76.91 68.33,76.91 v68.35,76.94 | v52.86,13.84 69.67,13.84 | v76.3,11.51 72.01,11.51 69.67,13.84 | v34.44,75.56 34.44,77.42 | 71.83,58.62 v72.06,58.39 | 60.96,45.92 61.93,44.96 66.98,44.96 67.59,44.35 67.59,42.09 67.97,41.71 69.34,41.71
  Bottom 0.813: C24.- 80.67,97.28 81.66,96.29 90.09,96.29 C25.+ | v80.72,73.99 80.62,73.89 C20.- 86.16,68.53 C28.-
N$1  (via drill 0.6)
  Top 0.406: U2.43 33.02,23.85 31.57,22.4 11.1,22.4 10.34,23.16 10.34,53.62 v10.49,53.77 11.18,53.09 37.87,53.09 38.58,53.8 U1.43 | v8.89,69.16 8.89,69.19 8.38,69.7 8.38,74.68 v9.37,75.67
  Bottom 0.406: v10.49,53.77 9.8,54.46 9.8,60.02 8.99,60.83 8.99,69.06 v8.89,69.16 | v9.37,75.67 9.5,75.79 11.35,75.79 X1.12
N$2
  Top 0.406: R13.1 25.28,99.21 | 25.28,99.21 24.92,99.57 23.04,99.57 22.4,100.2 R31.2 22.39,101.76 C9.1 | 25.28,99.21 26.69,99.21 27.53,100.05 U3.2
N$3  (via drill 0.6)
  Top 0.406: v11.94,50.01 11.91,49.99 11.91,25.3 12.47,24.74 31.27,24.74 31.98,25.45 U2.41 | U1.41 37.49,55.4 37.19,55.09 9.91,55.09 v8.81,56.19
  Bottom 0.406: X1.14 8.41,76.61 8.03,76.22 8.03,60.73 8.81,59.94 v8.81,56.19 8.84,56.16 8.84,53.14 10.69,51.28 10.72,51.28 11.94,50.06 v11.94,50.01
N$4  (via drill 0.6)
  Top 0.406: U1.39 v11.33,56.97 9.91,56.97 v7.67,59.21 | v13.18,51.36 13.18,28.35 14.73,26.8 30.58,26.8 30.84,27.05 U2.39
  Bottom 0.406: X1.16 8.15,77.41 7.34,76.61 7.34,59.54 v7.67,59.21 | v11.33,56.97 12.34,55.96 12.34,52.2 v13.18,51.36
N$5  (via drill 0.6)
  Top 0.406: U2.34 14.99,31.04 14.22,31.8 v14.22,40.61 | U1.34 41.43,61.9 40.89,62.43 8.23,62.43 v6.43,64.24
  Bottom 0.406: X1.18 7.42,78.21 6.45,77.24 6.45,66.19 6.43,66.17 v6.43,64.24 6.43,58.65 7.72,57.35 7.72,43.76 8.97,42.52 12.62,42.52 14.22,40.92 v14.22,40.61
N$6  (via drill 0.6)
  Top 0.406: v5.38,78.16 5.38,69.01 8.31,66.09 44.3,66.12 44.78,65.63 U1.32 | U2.32 38.28,35.56 37.69,36.14 v15.44,36.14
  Bottom 0.406: X1.22 9.17,79.81 8.51,79.15 6.32,79.15 5.38,78.21 v5.38,78.16 5.44,78.1 5.44,40 5.69,39.75 5.71,39.75 6.43,39.04 6.43,39.01 9.3,36.14 v15.44,36.14
N$7  (via drill 0.6)
  Top 0.406: U1.30 46.38,67.59 45.87,68.1 7.62,68.07 6.91,68.78 6.91,80.06 v7.47,80.62 4.29,80.62 3.4,79.73 3.4,59.28 v6.65,56.03 6.63,56.03 | U2.30 39.85,33.63 39.85,36.27 37.46,38.66 26.59,38.66 26.01,38.07 v15.47,38.07
  Bottom 0.406: v6.65,56.03 6.65,40.56 7.98,39.24 8,39.24 8,39.22 9.14,38.07 v15.47,38.07 | v7.47,80.62 11.37,80.62 X1.24
N$8  (via drill 0.6)
  Top 0.406: U1.40 36.8,56.21 36.53,55.93 22.35,55.96 v22.3,56.03 | U2.40 31.27,26.26 30.58,25.58 18.49,25.58 v18.29,25.78
  Bottom 0.406: X1.13 18.84,76.61 21.51,73.94 21.51,56.79 v22.3,56.03 22.99,55.35 22.99,54.03 22,53.03 19.41,53.03 17.91,51.54 17.91,27.25 17.93,27.23 17.93,26.11 18.26,25.78 v18.29,25.78
N$9  (via drill 0.6)
  Top 0.406: U2.38 v24.64,27.84 | U1.38 23.55,57.78 v22.63,58.7
  Bottom 0.406: X1.15 19.23,77.41 22.2,74.45 22.2,63.65 22.63,63.22 v22.63,58.7 23.9,57.43 23.9,28.57 v24.64,27.84 24.64,27.86
N$10  (via drill 0.6)
  Top 0.406: v23.8,63.52 U1.33 | U2.33 26.29,33.6 v25.22,34.67
  Bottom 0.406: X1.17 19.81,78.21 23.06,74.95 23.06,64.26 v23.8,63.52 23.85,63.47 23.85,58.78 25.22,57.4 v25.22,34.67
N$11
  Top 0.406: CLK_IN.1 37.36,70 46.61,70 47.9,68.63 47.98,68.55 U1.28
N$12  (via drill 0.6)
  Top 0.406: U1.29 47.19,67.97 46.23,68.94 26.14,68.91 v25.12,69.93 | U2.29 40.69,36.68 37.85,39.52 27.91,39.52 27.13,40.31 v27.13,40.54
  Bottom 0.406: X1.23 17.55,80.62 19.81,80.62 25.12,75.31 v25.12,69.93 25.15,69.9 25.15,68.35 25.88,67.61 25.88,59.31 27.13,58.06 v27.13,40.54
N$13
  Top 0.406: U1.10 51.18,46.66 52.58,45.26 55.17,45.26 55.7,44.73 55.7,42.85 R4.1
N$14
  Top 0.406: U1.9 50.37,46.1 51.84,44.63 51.84,42.88 R3.1
N$15
  Top 0.406: R2.1 48.29,45.01 49.56,46.28 49.56,50.42 U1.8
N$16
  Top 0.406: C2.2 51.59,65.94 51.21,65.56 51.21,63.58 U1.24
N$17
  Top 0.406: U1.7 48.77,46.96 44.61,42.8 R1.1
N$18
  Top 0.406: U1.3 45.57,50.42 45.57,49.02 44.96,48.41 R20.1 38.2,47.04 35.84,44.68 33.83,44.68 CONVST1.1
N$19
  Top 0.406: U1.11 51.97,47.29 53.16,46.1 57.78,46.1 57.96,45.92 | 57.96,45.92 59.33,44.55 59.33,42.9 R5.1 | R74.1 59.28,47.24 57.96,45.92
N$20
  Top 0.406: U2.10 44.68,16.31 46,14.99 R9.1
N$21
  Top 0.406: U2.9 43.87,13.77 42.67,12.57 42.67,11.23 R8.1
N$22
  Top 0.406: U2.8 43.08,14.1 42.01,13.03 39.9,13.03 39.29,12.42 39.29,11.23 R7.1 39.32,11.25
N$23
  Top 0.406: U2.7 42.27,14.53 41.55,13.82 39.52,13.82 38.43,12.72 36.04,12.72 35.66,12.34 35.66,11.18 R6.1
N$24
  Top 0.406: U2.24 44.68,36.61 C6.2
N$25  (via drill 0.6)
  Top 0.406: U2.3 39.09,18.57 38.48,17.95 R76.1 22.98,17.96 v21.08,17.96
  Bottom 0.406: CONV_ST2.1 v21.08,17.96
N$26
  Top 0.406: U2.11 45.47,16.87 47.32,15.01 48.74,15.01 | 48.74,15.01 49.33,14.43 R10.1 | 48.74,15.01 48.79,15.01 49.25,15.47 49.25,16.69 R72.1
N$27  (via drill 0.6)
  Top 0.406: U1.42 38.07,54.61 37.54,54.08 21.46,54.08 21.44,54.1 v21.44,54.13 | U2.42 32.51,24.66 31.09,23.24 17.37,23.24 v16.92,23.7
  Bottom 0.406: v16.92,23.7 16.92,52.68 20.83,56.59 | 20.83,56.59 20.83,73.51 18.52,75.82 X1.11 | 20.83,56.59 20.83,54.74 v21.44,54.13
N$28  (via drill 0.6)
  Top 0.406: 25.9,88.72 R11.2
  Top 0.508: v22.63,111.48 23.39,112.24 28.8,112.24 29.69,113.13 K3.2 | v23.32,88.72 25.9,88.72
  Bottom 0.61: v22.63,111.48 22.63,89.41 v23.32,88.72
N$29
  Top 0.406: 31.72,103.63 31.72,103.68 31.06,104.34 31.06,106.53 30.6,106.99 R14.1 | 31.72,103.63 31.72,99.97 32.92,98.78 U3.6 | 31.72,103.63 32.38,104.29 C19.2 32.79,104.38 R37.2
N$30  (via drill 0.6)
  Top 0.406: 45.54,63.6 U1.31 45.59,66.37 45.54,66.42 45.54,66.57 45.03,67.08 25.17,67.08 25.15,67.11 v24.56,67.11 | U2.31 39.09,35.97 37.49,37.57 27,37.57 v26.97,37.54
  Bottom 0.406: X1.21 19.4,79.81 24.05,75.16 24.05,67.69 24.56,67.18 v24.56,67.11 24.56,66.45 24.56,65.89 25.02,65.43 25.02,59.03 26.11,57.94 26.11,38.43 26.97,37.57 v26.97,37.54
N$31  (via drill 0.6)
  Top 0.508: v37.92,111.66 37.34,112.24 35.61,112.24 34.69,113.16 K3.1 | R15.2 37.9,91.75 v38.94,92.79
  Bottom 0.61: v37.92,111.66 37.92,104.93 38.86,103.99 39.78,103.99 42.44,101.32 42.44,94.84 41,93.4 40.39,92.79 v38.94,92.79
N$32
  Top 0.406: 22.45,97.43 R13.2
  Top 0.508: K2.1 20.44,98 21.01,97.43 22.45,97.43
N$33
  Top 0.406: U4.2 35.74,84.72 35.74,87.45 36.22,87.93 R15.1 40.29,87.93 40.47,87.74 | 40.47,87.74 40.77,87.45 40.77,86.62 C12.1 | R24.2 41.45,88.72 40.47,87.74
N$34
  Top 0.406: U4.1 40.58,84.69 C12.2 41.64,84.77 42.11,85.24 42.11,87.43 42.65,87.96 R16.2 R24.1
N$35
  Top 0.813: 95.66,107.01 IC1.3 91.03,107.09 90.27,106.32 90.27,105.69 | 90.27,105.69 C25.- | D2.C 85.65,106.48 86.49,105.64 90.22,105.64 90.27,105.69
N$36
  Top 0.813: D1.C 75.59,107.68 C24.+ 75.59,95.15 76.71,94.03 85.32,94.03 87.05,92.3 IC2.2
N$37
  Top 0.813: R17.2 82.1,78.16 LED5.A
N$38  (1 unrouted)
N$39
  Top 0.813: 75.64,110.44 D1.A 75.67,118.42 K1.3
N$40
  Top 0.813: D2.A K1.1
N$41
  Top 0.508: R19.2 105,63.12 LED7.A
N$43  (via drill 0.6)  (1 unrouted)
  Top 0.508: v115.44,31.75 115.44,52.3 114.53,53.21 110.36,53.21 | R32.2 73.76,44.09 75.23,42.62 78.23,42.62 83.67,37.19 95.05,37.19 99.21,33.02 99.21,31.39 v99.87,30.73
  Bottom 0.508: v99.87,30.73 114.43,30.73 v115.44,31.75
N$44
  Top 0.508: R33.2 94.64,36.09 97.66,33.07 97.66,30.61 98.65,29.62 112.22,29.62 114,31.39 114,47.47 113.36,48.11 K6.1
N$45
  Top 0.406: R11.1 28.75,88.75 R25.2 | C13.1 28.75,85.05 R25.2 | R25.2 30.43,85.02 30.99,84.45 30.99,83.06 31.52,82.53 33.83,82.53 34.44,83.13 U4.3
N$46
  Top 0.406: U4.6 34.44,80.97 35.89,82.43 R26.2 43.84,82.43 | 43.84,82.43 44.12,82.14 C14.2 | R16.1 44.25,82.83 43.84,82.43
N$48
  Top 0.406: CLK_IN1.1 27.76,41.5 28.75,40.51 38.28,40.51 41.45,37.34 41.45,33.63 U2.28
N$50  (via drill 0.6)
  Top 0.406: U1.1 30.2,50.42 v30.18,50.39 | v8.97,82.17 21.11,82.17 22.33,80.95 22.35,80.95 28.04,75.26 v28.04,74.29
  Bottom 0.406: v30.18,50.39 30.18,50.47 29.24,51.41 29.24,58.62 28.07,59.79 28.07,73.79 | 28.07,73.79 28.07,74.27 v28.04,74.29 28.04,73.81 28.07,73.79 | X1.28 9.01,82.21 v8.97,82.17
N$52  (via drill 0.6)
  Top 0.406: U2.1 37.49,19.15 37.03,18.69 26.87,18.69 26.29,19.28 v26.29,19.61
  Bottom 0.406: X1.27 19.51,82.21 26.49,75.23 26.49,68.3 27.08,67.72 27.08,59.46 28.17,58.37 28.17,35.66 25.35,32.84 25.35,28.96 26.24,28.07 26.24,19.66 v26.29,19.61
N$53
  Top 0.406: 41.22,105.21 R27.2
  Top 0.508: K4.2 43.59,108.86 43.03,108.31 41.55,108.31 41.22,107.97 41.22,105.21
N$54
  Top 0.406: 22.48,94.13 R12.2 | 15.39,119.43 K2.2
  Top 0.508: 22.48,94.13 21.01,94.13 20.47,94.67 20.47,95.76 19.43,96.8 19.43,109.83 15.39,113.87 15.39,119.43
N$55
  Top 0.406: R12.1 26.62,94.08 27.43,94.89 27.43,98.17 28.04,98.78 U3.3 31.37,98.78 32.28,97.87 R36.2 32.28,91.13 32.46,90.96 C18.1
N$56
  Top 0.406: C9.2 24.92,104.55 25.2,104.26 R31.1 27.1,101.75 27.53,101.32 U3.1 29.73,102.09 29.16,102.67 29.16,104.16 R14.2
N$57
  Top 0.406: 48.59,108.63 R28.2
  Top 0.508: K4.1 48.59,108.63
N$58
  Top 0.406: 50.04,103.89 49.81,104.12 48.87,104.12 48.56,104.42 R28.1 R30.2 | 50.04,103.89 U5.2 | C31.1 52.69,103.8 52.43,104.06 50.22,104.06 50.04,103.89
N$59
  Top 0.406: U5.1 51.33,102.05 C31.2 54.32,102.05 54.74,102.46 54.74,103.71 55.04,104.01 56.54,104.01 R29.2 55.24,104.07 54.36,104.95 54.36,108.18 53.95,108.59 52.5,108.59 R30.1
N$60
  Top 0.406: 44,99.47 R38.2 | R38.2 47.93,99.44 48.77,100.28 U5.3 | R27.1 C32.1 43.73,99.73 R38.2
N$61
  Top 0.406: R33.1 72.59,36.09 72.03,35.53 71.88,35.53 | 71.88,35.53 70.52,35.53 U6.2 | 71.88,35.53 73.68,33.73 R35.2 71.39,32.41 C16.1
N$62
  Top 0.406: C16.2 70.5,30.62 70.15,30.96 70.15,33.04 70.51,33.4 70.51,34.17 U6.1 | C16.2 76.06,30.62 76.45,31.01 76.45,32.38 R35.1 | R34.2 C16.2
N$63
  Top 0.406: C17.1 66.81,40.94 R46.2 | C17.1 66.81,38.67 68.73,36.75 U6.3 | C17.1 66.84,43.03 66.84,44.11 67.08,44.35 69.21,44.35 R32.1
N$64
  Top 0.406: U6.6 66.88,36.75 67.97,35.66 67.97,32.92 67.83,32.78 | 67.83,32.78 66.9,31.85 66.9,30.36 R47.2 67.01,30.25 67.01,28.88 66.62,28.5 66.17,28.5 65.85,28.18 C41.2 | R34.1 68.55,32.06 67.83,32.78
N$65
  Top 0.406: 53.02,99.38 53.74,98.66 R39.2 57.43,98.65 57.89,98.2 C33.2 | 53.02,99.38 52.63,99.77 49.96,99.77 48.77,98.58 U5.6 | R29.1 54.91,101.27 53.02,99.38
N$66
  Top 0.406: 51.56,88.72 R40.2
  Top 0.508: K5.2 58.32,107.04 59.66,105.69 59.66,95.48 58.72,94.54 56.97,94.54 56.08,93.65 56.08,89.56 55.24,88.72 51.56,88.72
N$67
  Top 0.406: 63.42,118.97 K5.1
  Top 0.508: 63.42,118.97 63.42,114.32 62.59,113.49 61.54,113.49 60.81,112.75 60.81,94.87 59.92,93.98 R41.2
N$68
  Top 0.406: U7.2 59.94,85.35 59.94,88.82 | C36.1 63.5,86.04 R43.2 63.42,88.82 59.94,88.82 | 59.94,88.82 R41.1
N$69
  Top 0.406: R43.1 65.1,91.7 65.35,91.44 65.35,86.02 | 65.35,86.02 C36.2 65.31,84.92 65.07,84.68 62.76,84.68 62.08,85.37 61.33,85.37 U7.1 | 65.35,86.02 68.18,86.02 R42.2
N$70
  Top 0.406: R40.1 51.49,83.57 | 51.49,83.57 51.49,81.7 C37.1 | 51.49,83.57 52.32,82.73 R44.2 57.74,82.73 58.75,83.74 58.75,85.28 U7.3
N$71
  Top 0.406: 64.41,82.85 64.92,82.35 R45.2 66.52,81.58 67.6,80.5 C38.2 | 64.41,82.85 64.29,82.98 59.23,82.98 58.7,82.45 58.7,80.13 U7.6 | R42.1 64.79,83.23 64.41,82.85
N$72  (via drill 0.6)
  Top 0.508: K7.2 91.08,39.6 89.97,40.72 89.97,58.44 v88.49,59.92 | v74.65,59.84 70.76,59.84 70.13,59.21 70.13,58.9 R48.2
  Bottom 0.406: 74.73,59.92 v74.65,59.84
  Bottom 0.61: v88.49,59.92 74.73,59.92
N$73
  Top 0.406: K7.1
  Top 0.508: R49.2 77.24,61.49 77.67,61.92 83.82,61.92 84.96,60.78 84.96,57.61 85.6,56.97 87.6,56.97 88.8,55.78 88.8,38.73 89.41,38.12 95.61,38.12 99.14,34.59 K7.1
N$74
  Top 0.406: R49.1 77.24,56.29 77.88,55.65 | 77.88,55.65 77.88,54.06 U8.2 | 77.88,55.65 79.58,57.35 R51.2 C44.1
N$75  (1 unrouted)
  Top 0.406: C44.2 83.02,55.83 | 83.02,55.83 83.02,59.7 82.7,60.02 81.41,60.02 R51.1 | R50.2 84.01,54.84 83.02,55.83
N$76
  Top 0.406: 72.67,50.35 R52.2 74.97,50.5 76.71,52.25 76.71,53.96 U8.3 | 70.1,50.41 C45.1
  Top 0.61: C45.1 72.67,50.35 | R48.1 70.1,50.41
N$77
  Top 0.406: R53.2 82.14,50.35 | 82.14,50.35 81.35,50.35 80.34,51.36 77.75,51.36 76.73,50.34 76.73,48.83 U8.6 | 82.14,50.35 82.19,50.39 83.95,50.39 84.35,49.99 84.35,49.35 84.51,49.2 85.43,49.2 C46.2 85.42,49.39 85.42,50.47 85.9,50.95 R50.1
N$78
  Top 0.406: 90.81,33.81 R54.2
  Top 0.508: K8.2 96.39,26.8 95.15,28.04 95.15,32.82 94.16,33.81 90.81,33.81
N$79
  Top 0.406: 93.3,26.34 R55.2
  Top 0.508: K8.1 96.08,21.8 95.38,22.5 95.38,25.7 94.74,26.34 93.3,26.34
N$80
  Top 0.406: U9.2 86.8,25.96 88.37,25.96 88.7,26.29 R55.1 R57.2 90.18,22.69 C49.1
N$81
  Top 0.406: 89.56,20.94 C49.2 86.42,20.94 85.88,21.49 85.88,23.27 86.64,24.03 86.64,24.53 U9.1 | 89.56,20.94 92.67,20.94 93.22,21.49 93.22,22.93 R57.1 | R56.2 88.65,20.03 89.56,20.94
N$82
  Top 0.406: C50.1 83.09,31.44 R58.2 83.25,28.62 84.63,27.23 86.75,27.23 U9.3
  Top 0.508: R54.1 C50.1
N$83
  Top 0.406: U9.6 81.6,27.18 83.16,27.18 84.23,26.11 84.23,23.34 83.29,22.41 R59.2 83.39,20.96 83.39,19.68 83.21,19.51 82.52,19.51 82.23,19.21 C51.2 R56.1
N$84
  Top 0.406: 110.16,13.31 K9.2
  Top 0.508: R60.2 102.99,10.49 103.99,11.48 103.99,12.47 104.83,13.31 110.16,13.31
N$85
  Top 0.508: R61.2 102.94,7.36 103.99,8.41 110.16,8.41 K9.1
N$86
  Top 0.406: U10.2 68.61,13.38 68.61,12.01 69.47,11.15 R61.1 R63.2 65.89,10.24 65.89,11.84 65.47,12.26 C54.1
N$87
  Top 0.406: 63.07,11.07 63.86,11.86 63.86,12.89 | 63.86,12.89 C54.2 | 63.07,11.07 63.5,11.07 64.13,10.44 64.13,7.7 64.47,7.37 R63.1 | 63.86,12.89 63.86,13.74 64.41,14.3 65.96,14.3 66.6,13.66 67.05,13.66 U10.1 | R62.2 63.07,11.07
N$88
  Top 0.406: C55.1 76.81,16 | 76.81,16 76.56,15.75 74.19,15.75 R64.2 70.35,15.82 69.77,15.24 69.77,13.48 U10.3 | 76.81,16 76.81,13.66 77.24,13.23 79.88,13.23 R60.1
N$89
  Top 0.406: 69.77,18.58 U10.6 69.82,16.97 68.78,15.93 66.04,15.93 65.46,16.51 R65.2 63.86,16.46 62.53,16.46 62.31,16.69 62.31,17.4 62.14,17.56 C56.2 R62.1
N$90  (via drill 0.6)
  Top 0.406: v11.66,64.41 8.56,64.41 7.34,65.63 v4.42,65.63
  Bottom 0.406: R67.1 13.54,71.32 13.05,71.81 X1.2 | R67.1 R66.1 | R68.1 5.49,90.22 | 5.49,90.22 3.94,90.22 3.38,89.66 3.35,89.66 3.1,89.41 3.1,66.27 3.73,65.63 v4.42,65.63 | R67.1 v11.66,64.42 v11.66,64.41 | R69.1 4.87,89.61 5.49,90.22
N$91
  Bottom 0.406: R67.2 13.56,61.65 11.15,61.65 10.59,62.2 10.59,69.67 10.16,70.1 10.16,73.08 10.5,73.41 X1.6
N$92  (1 unrouted)
  Bottom 0.406: R66.2 17.37,60.3 16.66,59.59 | X1.8 9.6,74.22 9.25,73.86 9.25,70.08 9.86,69.47 9.86,60.91 11.15,59.61 16.64,59.61
N$93
  Bottom 0.406: R69.2 11.37,83.82 X1.32
N$94
  Bottom 0.406: X1.34 9.75,84.61 9.25,85.11 9.25,87.07 8.89,87.42 R68.2
N$95
  Bottom 0.406: R70.2 18.29,57.61 19.41,58.72 19.41,72.06 18.85,72.62 17.55,72.62 X1.3
N$96
  Bottom 0.406: R70.1 14.14,56.29 14.68,55.75 18.03,55.75 20.14,57.86 20.14,72.9 18.83,74.21 X1.7
RD  (via drill 0.6)
  Top 0.406: U1.5 47.19,47.73 45.54,46.08 45.52,46.1 v41.66,46.1 | v9.02,91.8 9.02,84.96 9.7,84.28 19.05,84.28 v19.08,84.3 | U2.5 40.67,20.47 40.67,16.33 39.67,15.34 v29.62,15.34
  Bottom 0.406: X1.44 9.83,92.61 v9.02,91.8 | v19.08,84.3 19.68,84.3 22.96,81.03 22.99,81.03 27.28,76.73 30.76,76.73 31.19,76.3 31.19,63.88 31.72,63.35 33.68,63.35 35.79,61.24 35.79,49.07 36.45,48.41 40.74,48.41 41.38,47.78 41.38,46.38 v41.66,46.1 38.66,46.1 34.77,42.21 32.44,42.21 31.8,41.58 31.8,34.16 30.4,32.77 30.4,18.36 29.57,17.53 29.57,15.39 v29.62,15.34
VCC_3+  (via drill 0.6)
  Top 0.406: U1.36 38.71,59.38 38,60.1 32.97,60.1 v32.94,60.12 | U2.36 28.27,29.44 v27.94,29.77
  Bottom 0.406: v32.94,60.12 32.92,60.12 32.38,59.59 32.38,49.68 30.07,47.37 30.07,35.13 27.94,32.99 27.94,30.28 v27.94,29.77
VCC_5+
  Top 0.508: 104.95,68.6 R19.1 | R21.1
  Top 0.813: R21.1 107.62,68.63 R75.1 R19.1 | 112.47,71.96 C26.1 112.4,69.06 111.96,68.63 R21.1 | 104.95,68.6 103,68.6 102.36,67.97 102.36,66.93 101.14,65.71 98.58,65.71 97.97,65.1 U12.2
VCC_12+  (via drill 0.6)
  Top 0.406: 37.86,101.32 C10.2 | C39.2 61.33,80.04 U7.8 | C47.2 U8.8 | 51.33,96.84 U5.8 | 79.22,45.67 79.27,45.62 | 75.08,45.14 75.06,45.14 | U4.8 36.98,78.21 | 36.47,77 C15.2
  Top 0.508: U3.8 37.86,101.32 | 51.33,96.84 C34.2 52.67,93.84 v52.68,93.85 | 75.51,71.7 75.56,71.75 | C10.2 38.72,101.41 38.72,101.38 39.14,100.97 39.14,96.22 40.21,95.15 46.15,95.15 v47.45,93.85 | v62.36,22.05 62.41,22 62.41,21.97 63.2,21.18 C57.2 67.28,21.12 U10.8 | U9.8 C52.2 79.11,23.43 78.38,22.71 v74.65,22.71 | U8.8 79.22,45.67 | 79.27,45.62 78.51,45.62 77.01,44.12 75.59,44.12 75.08,44.63 75.08,45.14 | 75.06,45.14 v73.79,46.41 | v60.88,31.77 60.86,31.8 60.86,34.19 61.35,34.68 C42.2 62.9,34.68 63.37,34.21 U6.8
  Top 0.61: Q1.1 96.95,72.85 98.35,74.24 98.37,74.24 98.53,74.4 102.57,74.4 103.53,75.36 103.53,78.33 104.47,79.27 C23.+ | C39.2 61.33,72.91 62.53,71.7 68.35,71.7 71.63,68.43 75.44,68.43 C20.+ | U4.8 37.8,79.49 v39.65,77.65 | 36.98,78.21 36.47,77.7 36.47,77
  Top 0.813: IC2.3 75.62,78.21 R17.1 75.57,75.17 | 75.57,75.17 C59.1 | 75.57,75.17 75.57,72.41 | 75.57,72.41 75.57,71.75 75.56,71.75 75.56,68.55 C20.+ | Q1.1 85.83,72.85 84.3,71.32 76.66,71.32 75.57,72.41
  Bottom 0.508: 73.2,46.99 72.85,46.99
  Bottom 0.61: v39.65,77.65 55.7,77.65 56.46,76.89 56.46,73.63 57.12,72.97 71.91,72.97 | 71.91,72.97 71.98,72.97 72.54,72.41 72.54,69.19 73.2,68.53 | 73.2,68.53 C20.+ | v47.45,93.85 v52.68,93.85 69.7,93.85 70.61,92.94 70.61,74.27 71.91,72.97 | 73.2,68.53 73.2,46.99 v73.79,46.41 | v74.65,22.71 63.02,22.71 v62.36,22.05 60.88,23.52 v60.88,31.77 69.8,31.77 71.4,33.38 71.4,45.54 72.85,46.99
VCC_12-  (via drill 0.6)
  Top 0.406: 47.42,102.15 U5.4 | C43.1 70.24,38.25 U6.4 | U9.4 | U7.4 | 29.72,97.49 U3.4 | 28.35,92.07 v28.37,92.05
  Top 0.508: C35.1 47.42,102.15 | U7.4 C40.1 54.09,85.31 v53.62,85.78 | 29.72,97.49 C11.1 28.59,95.31 28.35,95.07 28.35,92.07 | v74.83,57.45 74.83,56.44 75.41,55.85 U8.4 75.36,54.04 C48.1 | U6.4 72.57,38.02 v73.84,39.29 | U10.4 71.11,13.41 72.69,13.41 73.32,12.79 C58.1 73.3,9.94 73.3,8.97 73.63,8.64 v86.31,8.64 | U9.4 88.8,28.48 89.23,28.9 90.32,28.9 90.68,29.26 90.68,30.65 C53.1 v93.42,30.66 | U4.4 32.81,84.69 31.52,85.98 C30.1 32.62,86.96 33.53,87.86 v33.53,88.67
  Top 0.61: C35.1 43.83,102.15 v43.41,102.56
  Top 0.813: C22.2 101.77,96.15 R18.2 | C21.- 100.94,93.12 101.83,94 101.83,96.11 R18.2 | IC1.2 107.01,97.87 105.28,96.14 101.8,96.14 R18.2
  Bottom 0.508: 100.84,88.65 C21.- 100.96,88.77 | v73.84,39.29 75.03,40.49 75.03,45.41 76.23,47.6 | 93.19,36.2 93.19,36.17 93.4,35.97 | 93.4,30.68 v93.42,30.66 | 43.33,102.49 43.48,102.49 | 41.99,88.67 41.99,88.52
  Bottom 0.61: v28.37,92.05 28.37,90.19 29.08,89.48 32.72,89.48 v33.53,88.67 39.5,88.67 41.99,88.67 44.83,91.52 44.83,101.14 43.48,102.49 | 100.84,88.65 100.84,60.68 98.78,58.62 75.39,58.62 74.83,58.06 v74.83,57.45 74.83,49 76.23,47.6 81.99,47.6 85.04,44.55 85.04,39.9 86.11,38.84 86.13,38.84 88.09,36.88 92.51,36.88 93.19,36.2 | v86.31,8.64 93.78,16.1 93.73,30.35 v93.42,30.66 | 93.4,35.97 93.4,30.68 | v53.62,85.78 44.73,85.78 41.99,88.52 | 43.33,102.49 v43.41,102.56 66.95,102.56 68.43,101.09 68.43,98.25 73.66,93.01 99.75,93.01 100.94,91.82 C21.-
VDD  (via drill 0.6)  (1 unrouted)
  Top 0.406: 30.45,61.39 38.1,61.39 39.29,60.2 U1.35 | 24.82,61.12 C5.2 | 41.94,40.03 R1.2 | 55.7,40.05 R4.2 | U1.25 50.37,69.09 46.71,72.75 42.01,72.75 | 54.91,17.25 v54.86,17.3 | U1.22 54.58,60.98 | 48.67,33.42 C8.2
  Top 0.508: 51.79,39.98 R3.2 | 51.79,33.6 C7.2 | 48.77,33.37 C8.2 48.62,33.38 | U2.25 43.87,35.03 43.13,35.76 43.13,37.11 41.83,38.4 41.83,39.93 R1.2 | U2.35 v37.16,30.25 | 39.17,8.35 R7.2 | 42.34,8.33 R8.2 | 45.95,8.38 R9.2 | U1.35 44.96,60.2 v45.83,61.07
  Top 0.61: 30.45,61.39 30.19,61.12 C1.2 24.82,61.12 | 41.94,40.03 R2.2 45.49,38.69 46.02,38.15 51.38,38.15 51.79,38.56 51.79,39.98 | R3.2 55.7,40.05 R5.2 62.3,40.05 62.79,40.54 62.79,46.46 64.11,47.78 v64.11,62.23 64.9,63.02 91.34,63.02 92.13,63.8 | C7.2 48.77,33.37 | R6.2 39.17,8.35 | v44.35,75.59 C4.2 C3.2 | 51.79,33.6 51.79,31.72 v52.1,31.42 | R1.2 40.59,40 40.31,40.28 40.31,41.22 v39.55,41.99 | R7.2 42.34,8.33 | R8.2 45.95,8.38 | R9.2 R10.2 53.79,8.33 54.91,9.45 54.91,17.25 | 54.58,60.98 54.58,62.03 v54.76,62.2 | U2.22 48.03,31.57 48.67,32.21 48.67,33.42
  Top 0.813: C27.1 102.97,72.01 102.26,72.72 100.28,72.72 Q1.3 100.3,72.69 100.3,68.66 99.24,67.59 C28.+ 92.13,67.54 92.13,63.8 92.91,63.02 U12.3
  Bottom 0.508: 64.11,62.2 v64.11,62.23 64.08,62.2 | v45.83,61.07 45.95,60.96
  Bottom 0.61: v54.86,17.3 54.86,28.65 v52.1,31.42 51.43,30.76 37.67,30.76 v37.16,30.25 35.05,30.25 34.59,30.71 34.59,39.14 37.44,41.99 v39.55,41.99 | v44.35,75.59 45.19,74.75 45.19,61.72 v45.83,61.07 | 64.08,62.2 v54.76,62.2 53.14,62.2 51.89,60.96 45.95,60.96
WE  (via drill 0.6)
  Top 0.406: v8.89,94.26 8.89,95.43 9.68,96.22 11.76,96.22 13.16,94.82 13.16,87.48 14.02,86.61 18.97,86.61 v20.6,84.99 | U1.6 47.98,47.27 45.85,45.14 v43.28,45.14 | U2.6 41.45,20.47 41.45,15.77 40.26,14.58 38.84,14.58 38,13.74 32.79,13.74 v32.18,13.74
  Bottom 0.406: X1.46 9.74,93.41 v8.89,94.26 | v20.6,84.99 20.65,84.99 27.94,77.7 30.99,77.7 32.18,76.5 32.18,65 33.05,64.13 34.11,64.13 36.78,61.47 36.78,50.29 37.72,49.35 40.92,49.35 42.72,47.55 42.72,45.67 43.26,45.14 v43.28,45.14 39.04,45.14 35.43,41.53 33.81,41.53 32.61,40.33 32.61,33.78 31.29,32.46 31.29,14.63 v32.18,13.74